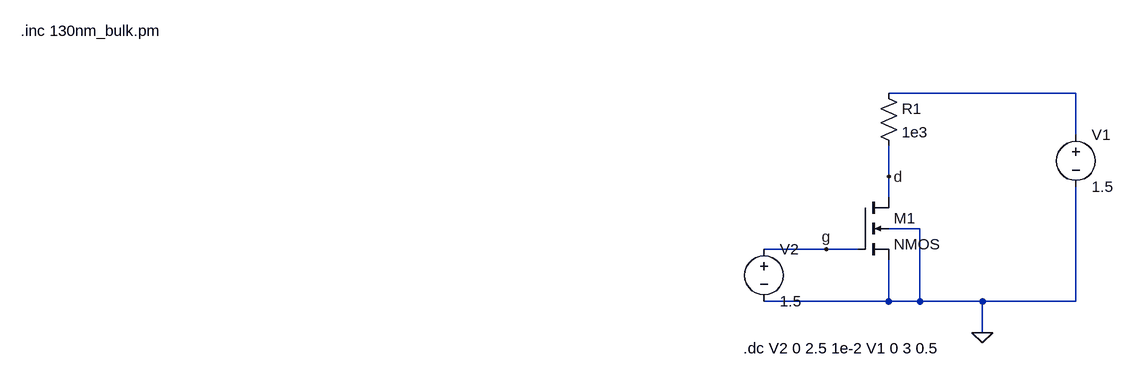
[diagram p0: schematic transmission_char.asc]
transmission_char.asc, the LTspice schematic file:
Version 4
SHEET 1 880 680
WIRE 480 -16 192 -16
WIRE 480 48 480 -16
WIRE 192 112 192 64
WIRE 192 144 192 112
WIRE 240 192 192 192
WIRE 96 224 0 224
WIRE 144 224 96 224
WIRE 192 304 192 240
WIRE 192 304 0 304
WIRE 240 304 240 192
WIRE 240 304 192 304
WIRE 336 304 240 304
WIRE 480 304 480 128
WIRE 480 304 336 304
WIRE 336 352 336 304
FLAG 336 352 0
FLAG 192 112 d
FLAG 96 224 g
SYMBOL res 176 -32 R0
SYMATTR InstName R1
SYMATTR Value 1e3
SYMBOL voltage 480 32 R0
WINDOW 123 0 0 Left 0
WINDOW 39 0 0 Left 0
SYMATTR InstName V1
SYMATTR Value 1.5
SYMBOL voltage 0 208 R0
WINDOW 123 0 0 Left 0
WINDOW 39 0 0 Left 0
SYMATTR InstName V2
SYMATTR Value 1.5
SYMBOL nmos4 144 144 R0
SYMATTR InstName M1
SYMATTR Value2 l=130e-9 w=260e-9 ad=676000e-18 as=676000e-18 pd=3640e-9 ps=3640e-9
TEXT -32 376 Left 2 !.dc V2 0 2.5 1e-2 V1 0 3 0.5
TEXT -1144 -112 Left 2 !.inc 130nm_bulk.pm

The netlist it stands for:
* transmission_char.asc
R1 N001 d 1e3
V1 N001 0 1.5
V2 g 0 1.5
M1 d g 0 0 NMOS l=130e-9 w=260e-9 ad=676000e-18 as=676000e-18 pd=3640e-9 ps=3640e-9
.model NMOS NMOS
.model PMOS PMOS
.lib standard.mos
.dc V2 0 2.5 1e-2 V1 0 3 0.5
.inc 130nm_bulk.pm
.backanno
.end

* Results of the author's LTspice run, read from the files saved beside the schematic
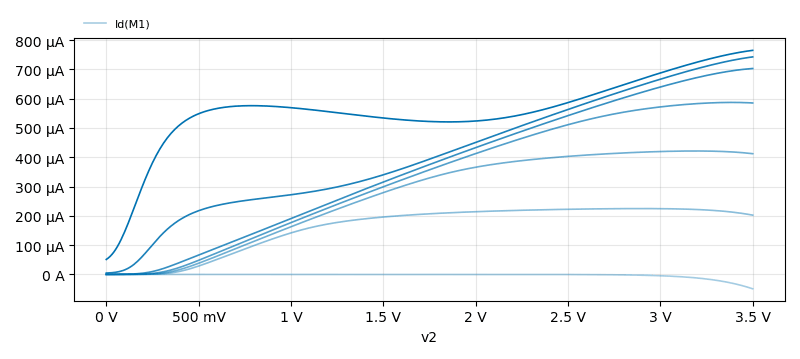
[diagram p1: DC transfer characteristic of transmission_char.asc, plotted from the saved traces]
* DC transfer characteristic, 7 runs:
*   Id(M1) [run 1]: 0 A at v2=0 V, -49.09 µA at v2=3.5 V, min -49.09 µA, max 0 A
*   Id(M1) [run 2]: 1.353 nA at v2=0 V, 202.3 µA at v2=3.5 V, min 1.353 nA, max 224.7 µA
*   Id(M1) [run 3]: 3.844 nA at v2=0 V, 412 µA at v2=3.5 V, min 3.844 nA, max 421.2 µA
*   Id(M1) [run 4]: 11.62 nA at v2=0 V, 585.1 µA at v2=3.5 V, min 11.62 nA, max 587 µA
*   Id(M1) [run 5]: 136.7 nA at v2=0 V, 702.8 µA at v2=3.5 V, min 136.7 nA, max 702.8 µA
*   Id(M1) [run 6]: 4.794 µA at v2=0 V, 742.4 µA at v2=3.5 V, min 4.794 µA, max 742.4 µA
*   Id(M1) [run 7]: 51.13 µA at v2=0 V, 764.7 µA at v2=3.5 V, min 51.13 µA, max 764.7 µA